# Altium schematic sheet Slave.SchDoc
size A4
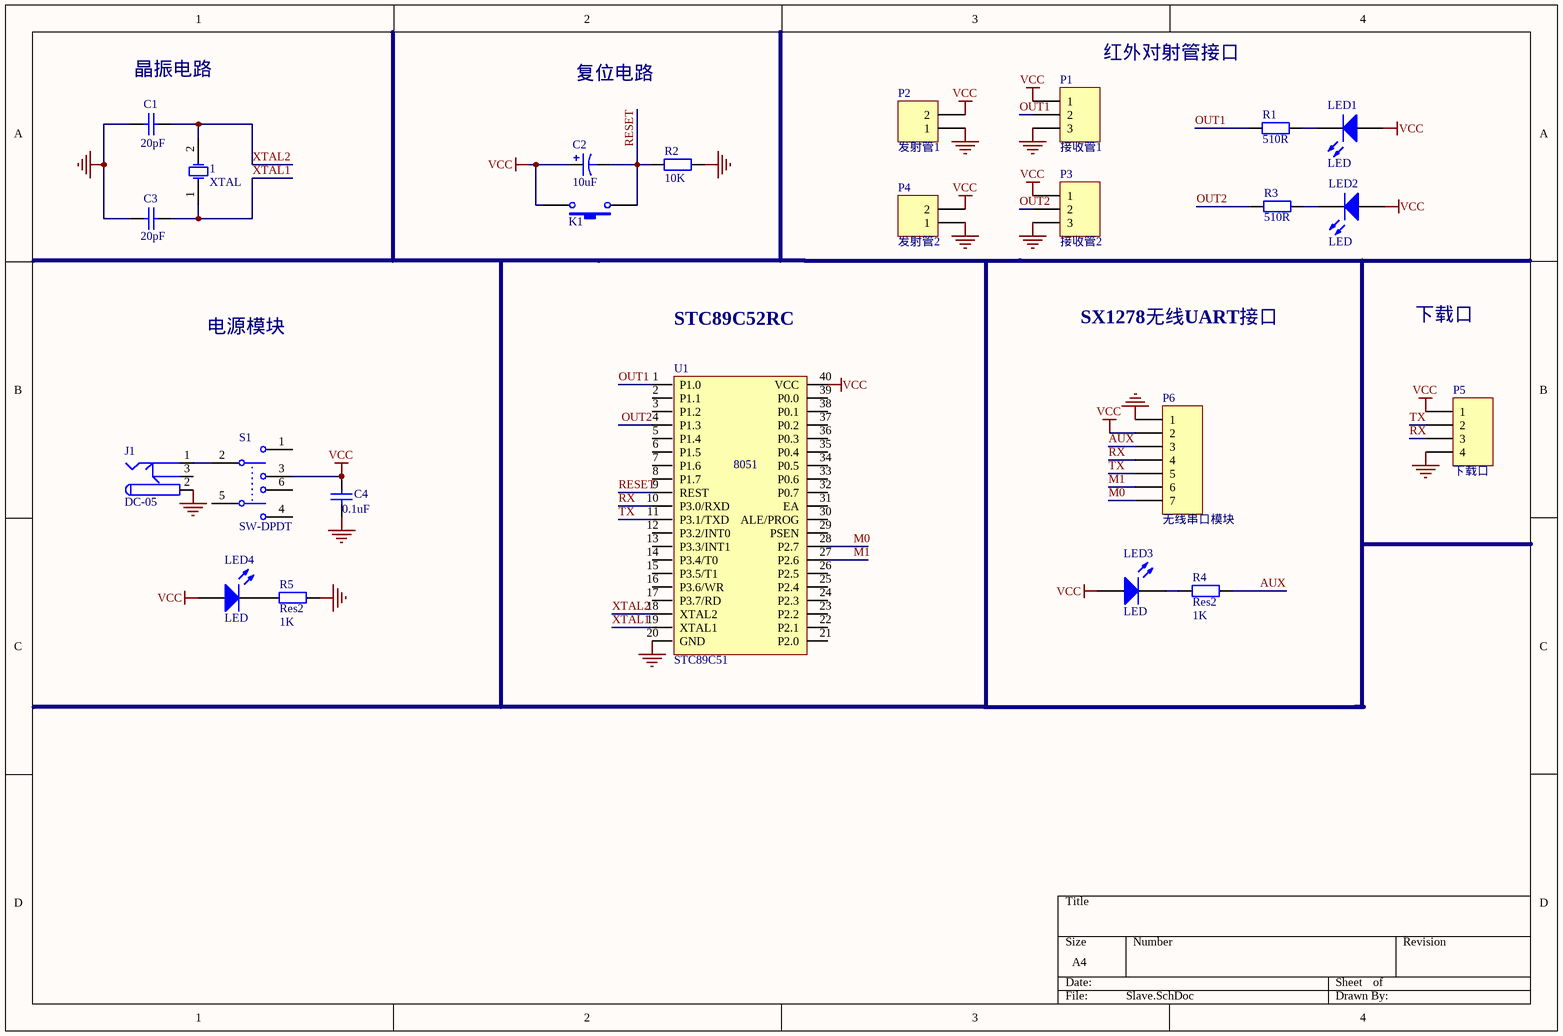
[diagram p0: Slave.SchDoc]

## Parts
1  XTAL  [XTAL_US]
C1  value 20pF  [RAD-0.1]  (hidden comment: Cap)
C2  value 10uF  [RB.1/.2]  (hidden comment: Cap Pol1)
C3  value 20pF  [RAD-0.1]  (hidden comment: Cap)
C4  value 0.1uF  [RAD-0.1]  (hidden comment: Cap)
J1  DC-05  [DC-05]
K1  四脚按键  [四脚按键]  (value not drawn)
LED1  LED  [LED]
LED2  LED  [LED]
LED3  LED  [LED]
LED4  LED  [LED]
P1  接收管1  [HDR1X3]
P2  发射管1  [HDR1X2]
P3  接收管2  [HDR1X3]
P4  发射管2  [HDR1X2]
P5  下载口  [HDR1X4]
P6  无线串口模块  [AS32-TTL-100]
R1  value 510R  [AXIAL-0.4]  (hidden comment: Res2)
R2  value 10K  [AXIAL-0.4]  (hidden comment: Res2)
R3  value 510R  [AXIAL-0.4]  (hidden comment: Res2)
R4  Res2  value 1K  [AXIAL-0.4]
R5  Res2  value 1K  [AXIAL-0.4]
S1  SW-DPDT  [SWITCH_B1]
U1  STC89C51  [DIP-40]

## Nets
GND: C1.1 C3.1 C4.1 J1.2 P1.3 P2.1 P3.3 P4.1 P5.4 P6.1 R2.2 R5.2 U1.20(GND)
VCC: C2.1 C4.2 K1.2 LED1.1 LED2.1 LED3.1 LED4.1 P1.1 P2.2 P3.1 P4.2 P5.1 P6.2 S1.3 U1.40(VCC)
AUX: P6.3 R4.2
M0: P6.7 U1.28(P2.7)
M1: P6.6 U1.27(P2.6)
OUT1: P1.2 R1.1 U1.1(P1.0)
OUT2: P3.2 R3.1 U1.4(P1.3)
RESET: C2.2 K1.1 R2.1 U1.9(REST)
RX: P5.3 P6.4 U1.10(P3.0/RXD)
TX: P5.2 P6.5 U1.11(P3.1/TXD)
XTAL1: 1.1(OSC1) C3.2 U1.19(XTAL1)
XTAL2: 1.2(OSC2) C1.2 U1.18(XTAL2)
NetJ1_1: J1.1 S1.2
NetLED1_2: LED1.2 R1.2
NetLED2_2: LED2.2 R3.2
NetLED3_2: LED3.2 R4.1
NetLED4_2: LED4.2 R5.1

Not connected (* = marked no-connect by the designer): J1 3; S1 1 4 5 6; U1 2(P1.1) 3(P1.2) 5(P1.4) 6(P1.5) 7(P1.6) 8(P1.7) 12(P3.2/INT0) 13(P3.3/INT1) 14(P3.4/T0) 15(P3.5/T1) 16(P3.6/WR) 17(P3.7/RD) 21(P2.0) 22(P2.1) 23(P2.2) 24(P2.3) 25(P2.4) 26(P2.5) 29(PSEN) 30(ALE/PROG) 31(EA) 32(P0.7) 33(P0.6) 34(P0.5) 35(P0.4) 36(P0.3) 37(P0.2) 38(P0.1) 39(P0.0)

## Notes on the sheet
- (near C1) 晶振电路
- 复位电路
- 红外对射管接口
- 电源模块
- STC89C52RC
- SX1278无线UART接口
- 下载口
- (in symbol STC89C51) 8051

## Library data of the parts
1 = XTAL: Crystal Oscillator; Published: 8-Jun-2000; LatestRevisionDate: 17-Jul-2002; LatestRevisionNote: Re-released for DXP Platform.; PackageReference: R38; Publisher: Altium Limited; PackageDescription: Crystal, Thru-Hole; 2 Leads; Body 3.1 x 8.2 mm (Dia.xH)
C1 C3 C4 = Cap: Capacitor; Published: 8-Jun-2000; LatestRevisionDate: 17-Jul-2002; LatestRevisionNote: Re-released for DXP Platform.; PackageReference: RAD-0.3; Publisher: Altium Limited; PackageDescription: Radial Cap, Thru-Hole; 2 Leads; 0.3 in Pin Spacing
C2 = Cap Pol1: Polarized Capacitor (Radial); Published: 8-Jun-2000; LatestRevisionDate: 17-Jul-2002; LatestRevisionNote: Re-released for DXP Platform.; PackageReference: RB7.6-15; Publisher: Altium Limited; PackageDescription: Polarized Capacitor (Radial); 2 Leads
P1 P3 = Header 3: Header, 3-Pin; LatestRevisionDate: 17-Jul-2002; LatestRevisionNote: Re-released for DXP Platform.; Publisher: Altium Limited
P2 P4 = Header 2: Header, 2-Pin; LatestRevisionDate: 17-Jul-2002; LatestRevisionNote: Re-released for DXP Platform.; Publisher: Altium Limited
P5 = Header 4: Header, 4-Pin; LatestRevisionDate: 17-Jul-2002; LatestRevisionNote: Re-released for DXP Platform.; Publisher: Altium Limited
P6 = Header 7: Header, 7-Pin; LatestRevisionDate: 17-Jul-2002; LatestRevisionNote: Re-released for DXP Platform.; Publisher: Altium Limited
R1-R5 = Res2: Resistor; Published: 8-Jun-2000; LatestRevisionDate: 17-Jul-2002; LatestRevisionNote: Re-released for DXP Platform.; PackageReference: AXIAL-0.4; Publisher: Altium Limited; PackageDescription: Axial Device, Thru-Hole; 2 Leads; 0.4 in Pin Spacing
S1 = SW-DPDT: 单刀双掷开关; Published: 24-Mar-1999; LatestRevisionDate: 17-Jul-2002; LatestRevisionNote: Re-released for DXP Platform.; PackageReference: DPDT-6; Publisher: Altium Limited